# Altium schematic sheet SH28 - EXPANSION2.SchDoc
size 386 x 246 mm
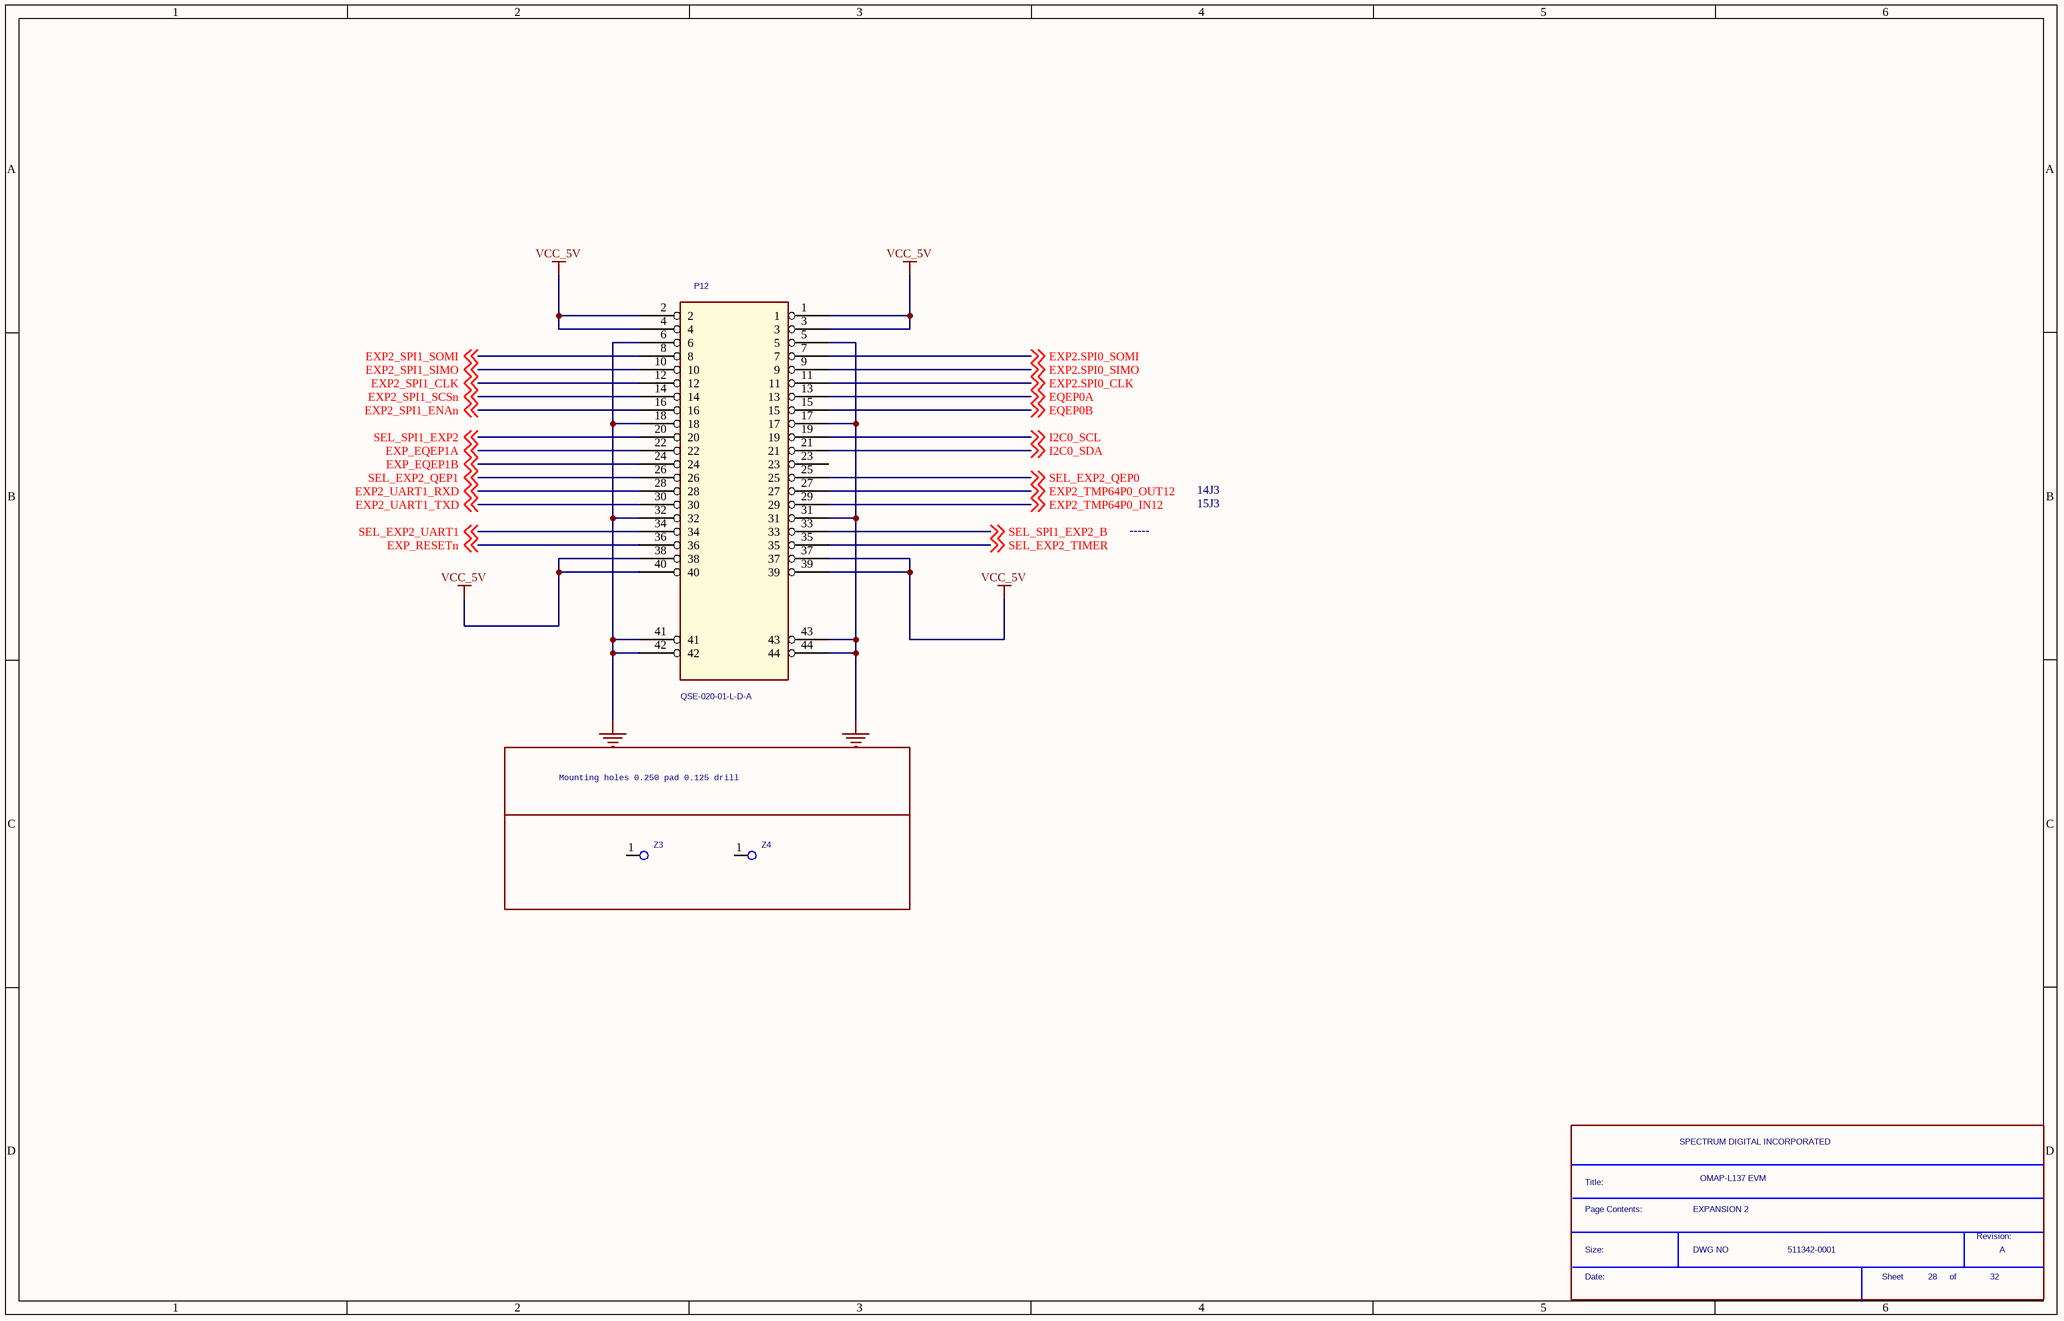
[diagram p0: SH28 - EXPANSION2.SchDoc]

## Parts
*  Page Contents:: EXPANSION 2  RevCode: A  Title: OMAP-L137 EVM  OrgName: SPECTRUM DIGITAL INCORPORATED  Doc: 511342-0001  Page Number: 28  Page Count: 32  (hidden comment: SDTitleBlock)  (graphical)
P12  QSE-020-01-L-D-A  [qse_020]
Z3  MNTHOLE  [TP1_0-2_0]  (value not drawn)
Z4  MNTHOLE  [TP1_0-2_0]  (value not drawn)

## Blocks framed on the sheet
Mounting holes 0.250 pad 0.125 drill: Z3 Z4

## Nets
GND: P12.5 P12.6 P12.17 P12.18 P12.31 P12.32 P12.41 P12.42 P12.43 P12.44
VCC_5V: P12.1 P12.2 P12.3 P12.4 P12.37 P12.38 P12.39 P12.40
EQEP0A: P12.13 ; off-sheet EQEP0A
EQEP0B: P12.15 ; off-sheet EQEP0B
EXP2.SPI0_CLK: P12.11 ; off-sheet EXP2.SPI0_CLK
EXP2.SPI0_SIMO: P12.9 ; off-sheet EXP2.SPI0_SIMO
EXP2.SPI0_SOMI: P12.7 ; off-sheet EXP2.SPI0_SOMI
EXP2_SPI1_CLK: P12.12 ; off-sheet EXP2_SPI1_CLK
EXP2_SPI1_ENAn: P12.16 ; off-sheet EXP2_SPI1_ENAn
EXP2_SPI1_SCSn: P12.14 ; off-sheet EXP2_SPI1_SCSn
EXP2_SPI1_SIMO: P12.10 ; off-sheet EXP2_SPI1_SIMO
EXP2_SPI1_SOMI: P12.8 ; off-sheet EXP2_SPI1_SOMI
EXP2_TMP64P0_IN12: P12.29 ; off-sheet EXP2_TMP64P0_IN12
EXP2_TMP64P0_OUT12: P12.27 ; off-sheet EXP2_TMP64P0_OUT12
EXP2_UART1_RXD: P12.28 ; off-sheet EXP2_UART1_RXD
EXP2_UART1_TXD: P12.30 ; off-sheet EXP2_UART1_TXD
EXP_EQEP1A: P12.22 ; off-sheet EXP_EQEP1A
EXP_EQEP1B: P12.24 ; off-sheet EXP_EQEP1B
EXP_RESETn: P12.36 ; off-sheet EXP_RESETn
I2C0_SCL: P12.19 ; off-sheet I2C0_SCL
I2C0_SDA: P12.21 ; off-sheet I2C0_SDA
SEL_EXP2_QEP0: P12.25 ; off-sheet SEL_EXP2_QEP0
SEL_EXP2_QEP1: P12.26 ; off-sheet SEL_EXP2_QEP1
SEL_EXP2_TIMER: P12.35 ; off-sheet SEL_EXP2_TIMER
SEL_EXP2_UART1: P12.34 ; off-sheet SEL_EXP2_UART1
SEL_SPI1_EXP2: P12.20 ; off-sheet SEL_SPI1_EXP2
SEL_SPI1_EXP2_B: P12.33 ; off-sheet SEL_SPI1_EXP2_B

Not connected (* = marked no-connect by the designer): P12 23; Z3 1; Z4 1

## Notes on the sheet
- -----
- 14J3
- 15J3
- (in symbol SDTitleBlock) Title:; Page Contents:; Revision:; Size:; DWG NO; Date:; Sheet; of

## Library data of the parts
P12 = QSE-020-01-L-D-A_0: Part #: 101881-0020R
Z3 Z4 = TestPoint1: ATLStockNo1: none